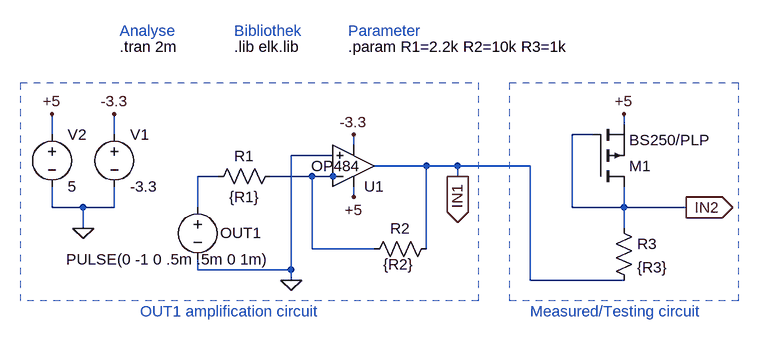
[diagram p0: schematic Draft_pMos-Schaltung_auf_Spice.asc]
Draft_pMos-Schaltung_auf_Spice.asc, the LTspice schematic file:
Version 4
SHEET 1 880 680
WIRE 656 96 656 80
WIRE -224 112 -224 80
WIRE -128 112 -128 80
WIRE 608 112 576 112
WIRE 240 128 240 112
WIRE 208 144 144 144
WIRE 352 160 272 160
WIRE 400 160 352 160
WIRE 512 160 400 160
WIRE 32 176 0 176
WIRE 176 176 112 176
WIRE 208 176 176 176
WIRE 400 176 400 160
WIRE 208 192 208 176
WIRE 240 208 240 192
WIRE -224 224 -224 192
WIRE -176 224 -224 224
WIRE -128 224 -128 192
WIRE -128 224 -176 224
WIRE 0 224 0 176
WIRE 576 224 576 112
WIRE 656 224 656 192
WIRE 656 224 576 224
WIRE 752 224 656 224
WIRE -176 256 -176 224
WIRE 656 256 656 224
WIRE 176 288 176 176
WIRE 272 288 176 288
WIRE 352 288 352 160
WIRE 0 320 0 304
WIRE 144 320 144 144
WIRE 144 320 0 320
WIRE 144 336 144 320
WIRE 512 336 512 160
WIRE 656 336 512 336
FLAG 240 208 +5
FLAG 240 112 -3.3
FLAG -176 256 0
FLAG -128 80 -3.3
FLAG -224 80 +5
FLAG 400 176 IN1
IOPIN 400 176 Out
FLAG 752 224 IN2
IOPIN 752 224 Out
FLAG 144 336 0
FLAG 656 80 +5
SYMBOL Opamps\\opamp2 240 224 M180
WINDOW 3 -65 64 Left 2
SYMATTR Value OP484
SYMATTR InstName U1
SYMBOL res 368 272 R90
WINDOW 0 0 56 VBottom 2
WINDOW 3 24 59 VTop 2
SYMATTR InstName R2
SYMATTR Value {R2}
SYMBOL voltage -128 96 R0
WINDOW 123 0 0 Left 0
WINDOW 39 0 0 Left 0
SYMATTR InstName V1
SYMATTR Value -3.3
SYMBOL voltage -224 96 R0
WINDOW 123 0 0 Left 0
WINDOW 39 0 0 Left 0
SYMATTR InstName V2
SYMATTR Value 5
SYMBOL voltage 0 208 R0
WINDOW 3 -202 96 Left 2
WINDOW 123 0 0 Left 0
WINDOW 39 0 0 Left 0
WINDOW 0 35 55 Left 2
SYMATTR Value PULSE(0 -1 0 .5m .5m 0 1m)
SYMATTR InstName OUT1
SYMBOL res 128 160 R90
WINDOW 0 0 56 VBottom 2
WINDOW 3 32 56 VTop 2
SYMATTR InstName R1
SYMATTR Value {R1}
SYMBOL res 640 240 R0
SYMATTR InstName R3
SYMATTR Value {R3}
SYMBOL pmos 608 192 M180
SYMATTR InstName M1
SYMATTR Value BS250/PLP
SYMATTR Prefix XMP
TEXT -88 384 Left 2 ;OUT1 amplification circuit
TEXT 512 384 Left 2 ;Measured/Testing circuit
TEXT -120 -24 Left 2 !.tran 2m
TEXT 56 -24 Left 2 !.lib elk.lib
TEXT 232 -24 Left 2 !.param R1=2.2k R2=10k R3=1k
TEXT -120 -48 Left 2 ;Analyse
TEXT 56 -48 Left 2 ;Bibliothek
TEXT 232 -48 Left 2 ;Parameter
RECTANGLE Normal 432 368 -272 32 1
RECTANGLE Normal 832 368 480 32 1

The netlist it stands for:
* Draft_pMos-Schaltung_auf_Spice.asc
XU1 0 N002 +5 -3.3 IN1 OP484  ; pins In+ In- V+ V- OUT
R2 IN1 N002 {R2}
V1 -3.3 0 -3.3
V2 +5 0 5
V§OUT1 N001 0 PULSE(0 -1 0 .5m .5m 0 1m)
R1 N002 N001 {R1}
R3 IN2 IN1 {R3}
XM1 IN2 IN2 +5 BS250/PLP  ; pins D G S
* OUT1 amplification circuit
* Measured/Testing circuit
.tran 2m
.lib elk.lib
.param R1=2.2k R2=10k R3=1k
* Analyse
* Bibliothek
* Parameter
.backanno
.end